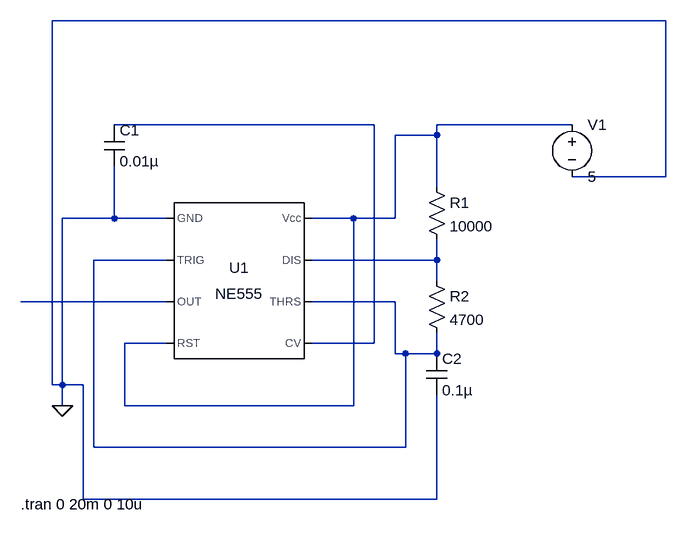
[diagram p0: schematic IC555 Astable.asc]
IC555 Astable.asc, the LTspice schematic file:
Version 4.1
SHEET 1 880 680
WIRE 784 -224 -160 -224
WIRE 336 -64 -64 -64
WIRE 640 -64 432 -64
WIRE 432 -48 432 -64
WIRE 432 -48 368 -48
WIRE 784 16 784 -224
WIRE 784 16 640 16
WIRE 432 32 432 -48
WIRE -64 80 -64 0
WIRE -64 80 -144 80
WIRE 16 80 -64 80
WIRE 304 80 240 80
WIRE 368 80 368 -48
WIRE 368 80 304 80
WIRE 16 144 -96 144
WIRE 432 144 432 112
WIRE 432 144 240 144
WIRE 432 176 432 144
WIRE 16 208 -208 208
WIRE 368 208 240 208
WIRE 16 272 -48 272
WIRE 336 272 336 -64
WIRE 336 272 240 272
WIRE 368 288 368 208
WIRE 384 288 368 288
WIRE 432 288 432 256
WIRE 432 288 384 288
WIRE -160 336 -160 -224
WIRE -144 336 -144 80
WIRE -144 336 -160 336
WIRE -112 336 -144 336
WIRE -144 368 -144 336
WIRE -48 368 -48 272
WIRE 304 368 304 80
WIRE 304 368 -48 368
WIRE -96 432 -96 144
WIRE 384 432 384 288
WIRE 384 432 -96 432
WIRE -112 512 -112 336
WIRE 432 512 432 352
WIRE 432 512 -112 512
FLAG -144 368 0
SYMBOL Misc\\NE555 128 176 R0
SYMATTR InstName U1
SYMBOL cap -80 -64 R0
SYMATTR InstName C1
SYMATTR Value 0.01µ
SYMBOL voltage 640 -80 R0
WINDOW 123 0 0 Left 0
WINDOW 39 0 0 Left 0
SYMATTR InstName V1
SYMATTR Value 5
SYMBOL res 416 16 R0
SYMATTR InstName R1
SYMATTR Value 10000
SYMBOL res 416 160 R0
SYMATTR InstName R2
SYMATTR Value 4700
SYMBOL cap 416 288 R0
SYMATTR InstName C2
SYMATTR Value 0.1µ
TEXT -208 520 Left 2 !.tran 0 20m 0 10u

The netlist it stands for:
* IC555 Astable.asc
X§U1 0 N003 N005 N002 N001 N003 N004 N002 NE555  ; pins GND TRIG OUT RST CV THRS DIS Vcc
C1 N001 0 0.01µ
V1 N002 0 5
R1 N002 N004 10000
R2 N004 N003 4700
C2 N003 0 0.1µ
.tran 0 20m 0 10u
.lib NE555.sub
.backanno
.end